# Altium project Node01.PrjPcb
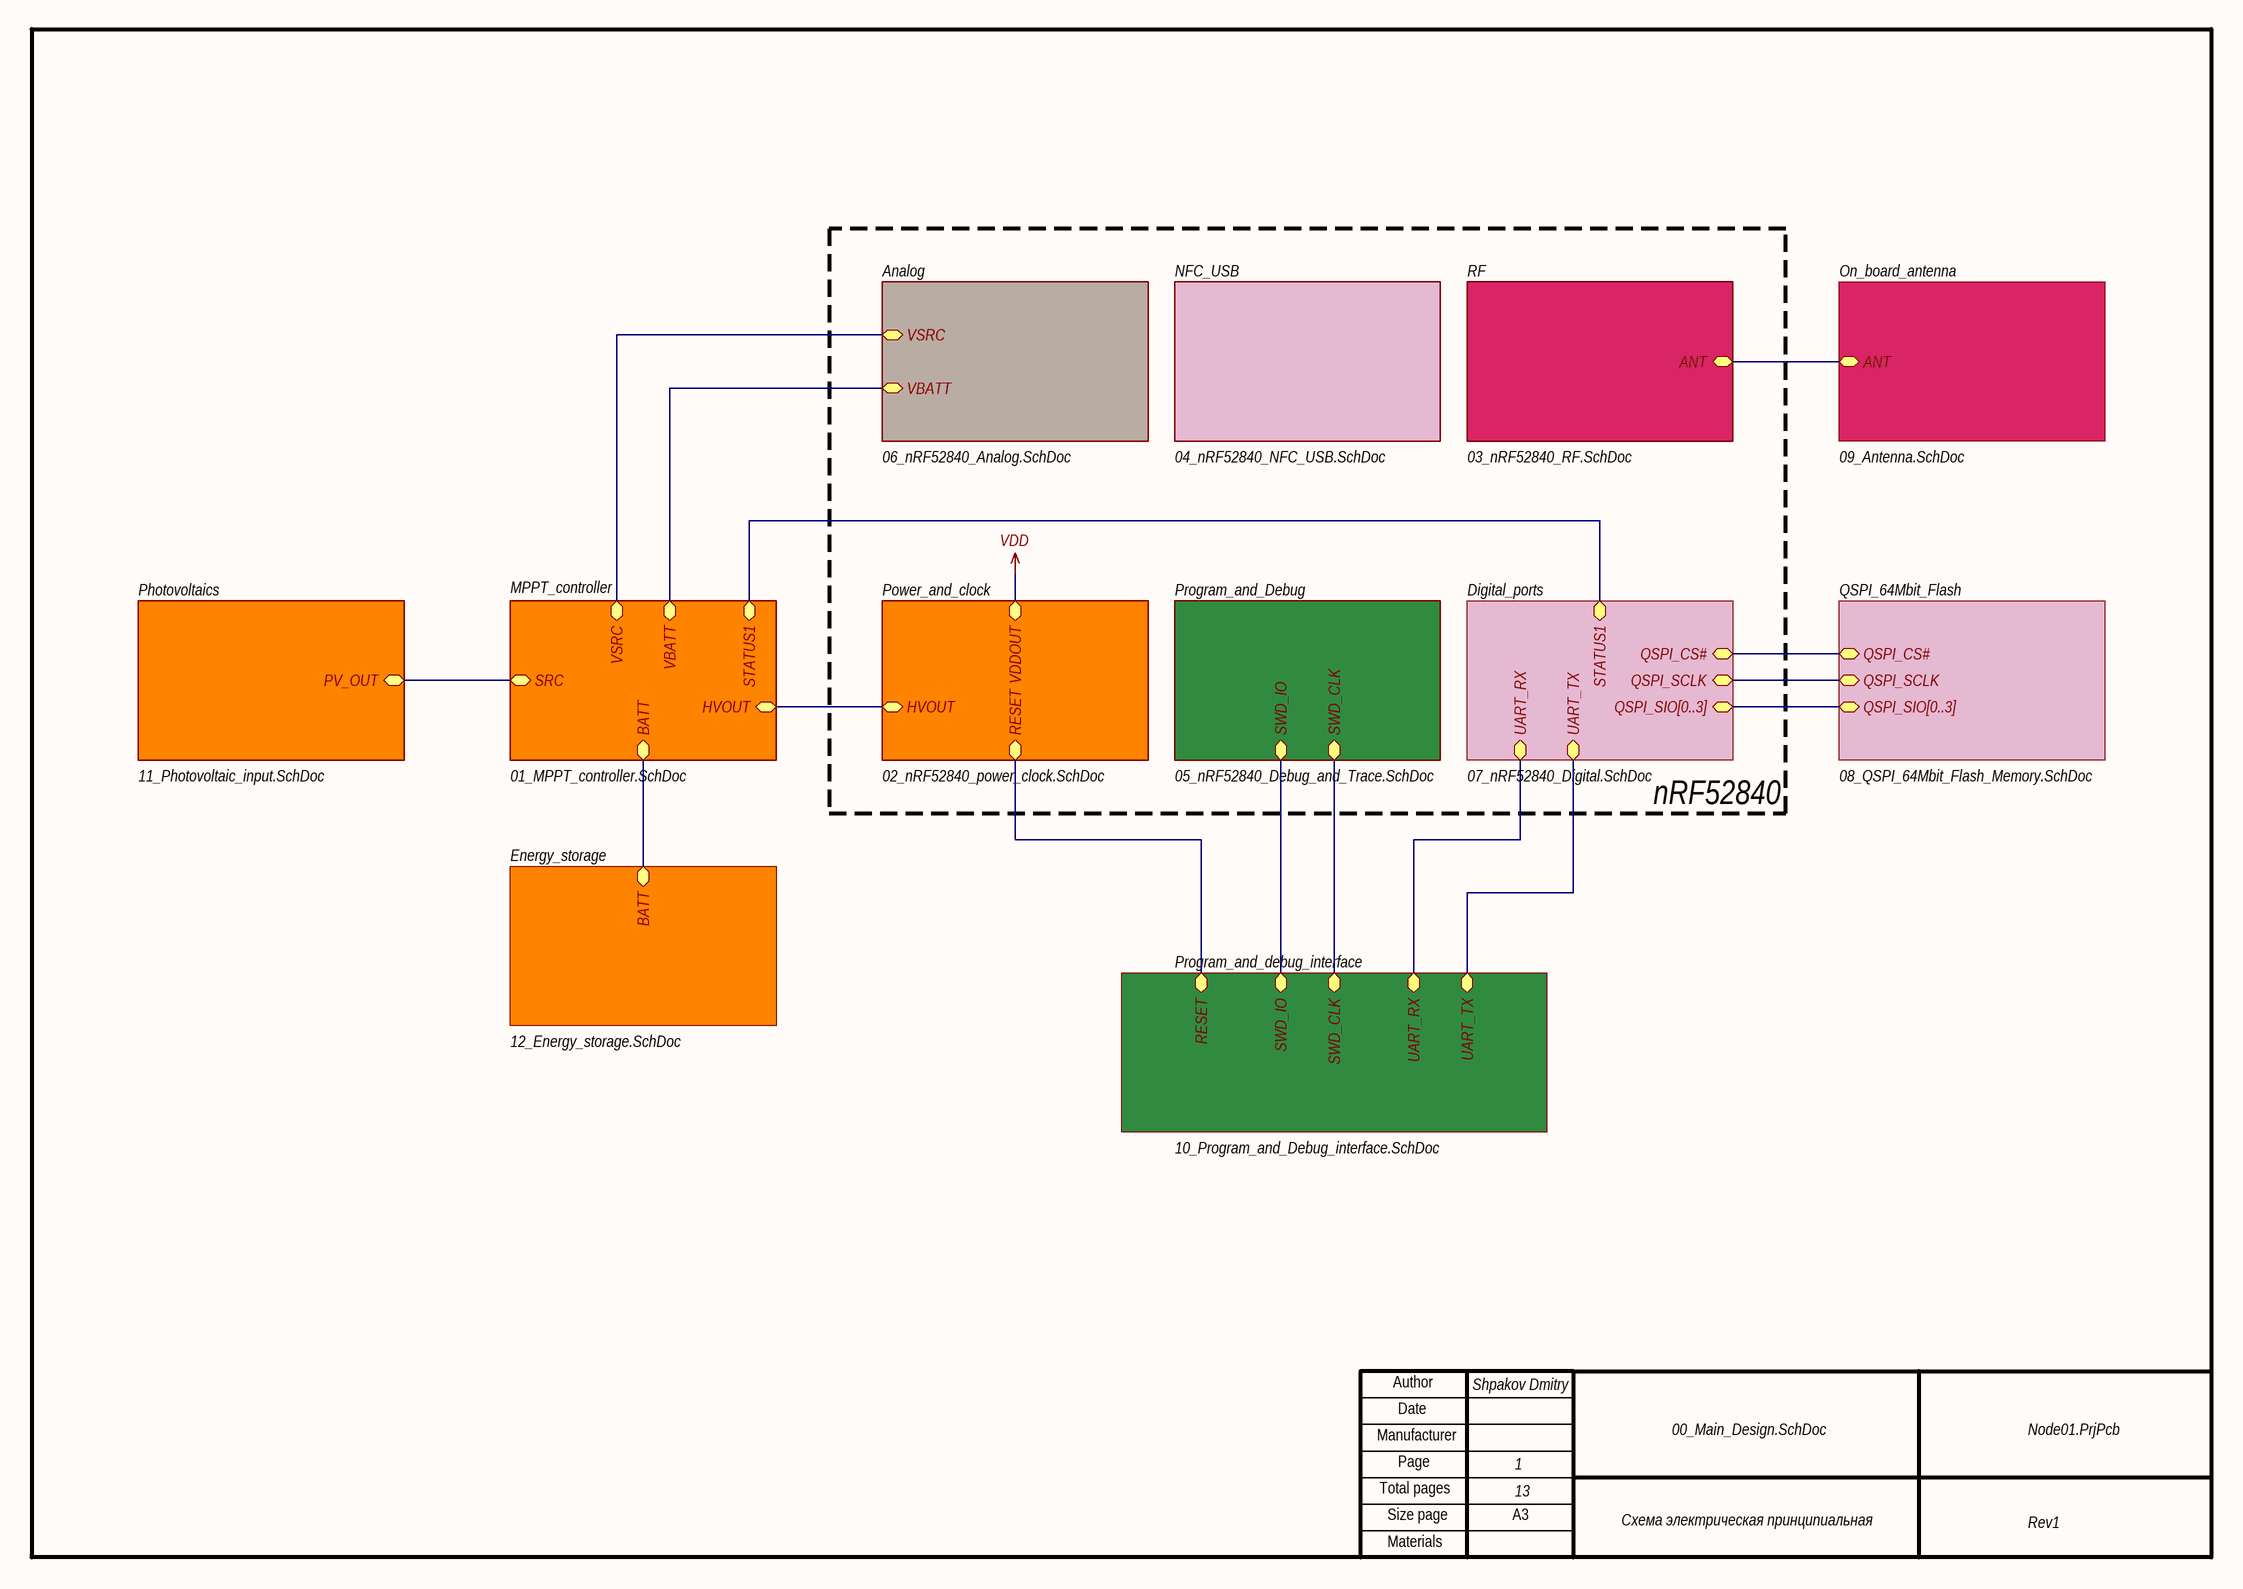
[diagram p0: 00_Main_Design.SchDoc]
ProjectRevision: Rev1
13 sheets, 47 parts. Net scope: hierarchical (ports join the sheet entries above them; power ports are global).
Board file: PCB.PcbDoc
Sheets:
  00_Main_Design.SchDoc
    MPPT_controller = 01_MPPT_controller.SchDoc
    Power_and_clock = 02_nRF52840_power_clock.SchDoc
    RF = 03_nRF52840_RF.SchDoc
    NFC_USB = 04_nRF52840_NFC_USB.SchDoc
    Analog = 06_nRF52840_Analog.SchDoc
    Digital_ports = 07_nRF52840_Digital.SchDoc
    Program_and_Debug = 05_nRF52840_Debug_and_Trace.SchDoc
    QSPI_64Mbit_Flash = 08_QSPI_64Mbit_Flash_Memory.SchDoc
    On_board_antenna = 09_Antenna.SchDoc
    Program_and_debug_interface = 10_Program_and_Debug_interface.SchDoc
    Photovoltaics = 11_Photovoltaic_input.SchDoc
    Energy_storage = 12_Energy_storage.SchDoc

## Sheet 00_Main_Design.SchDoc
size 420 x 297 mm; Author: Shpakov Dmitry; Address1: Address1; Address2: Address2; Address3: Address3; Address4: Address4; DocumentNumber: АБВГ.123456.001 Э3; SheetNumber: 1; SheetTotal: 13; Scale: 1:1; DocumentType: Схема электрическая принципиальная; FirstReferrence: АБВГ.123456.001

### Sub-sheets
Analog = 06_nRF52840_Analog.SchDoc: VSRC, VBATT
Digital_ports = 07_nRF52840_Digital.SchDoc: UART_TX, UART_RX, STATUS1, QSPI_SIO[0..3], QSPI_SCLK, QSPI_CS#
Energy_storage = 12_Energy_storage.SchDoc: BATT
MPPT_controller = 01_MPPT_controller.SchDoc: STATUS1, HVOUT, VSRC, VBATT, SRC, BATT
NFC_USB = 04_nRF52840_NFC_USB.SchDoc: no entries
On_board_antenna = 09_Antenna.SchDoc: ANT
Photovoltaics = 11_Photovoltaic_input.SchDoc: PV_OUT
Power_and_clock = 02_nRF52840_power_clock.SchDoc: HVOUT, RESET, VDDOUT
Program_and_Debug = 05_nRF52840_Debug_and_Trace.SchDoc: SWD_CLK, SWD_IO
Program_and_debug_interface = 10_Program_and_Debug_interface.SchDoc: UART_RX, SWD_IO, UART_TX, RESET, SWD_CLK
QSPI_64Mbit_Flash = 08_QSPI_64Mbit_Flash_Memory.SchDoc: QSPI_SIO[0..3], QSPI_SCLK, QSPI_CS#
RF = 03_nRF52840_RF.SchDoc: ANT

### Nets
VDD: sheet MPPT_controller/HVOUT, sheet Power_and_clock/HVOUT, sheet Power_and_clock/VDDOUT
ANT: sheet RF/ANT, sheet On_board_antenna/ANT
BATT: sheet MPPT_controller/VBATT, sheet MPPT_controller/BATT, sheet Analog/VBATT, sheet Energy_storage/BATT
PV+: sheet MPPT_controller/VSRC, sheet MPPT_controller/SRC, sheet Analog/VSRC, sheet Photovoltaics/PV_OUT
QSPI_CS#: sheet Digital_ports/QSPI_CS#, sheet QSPI_64Mbit_Flash/QSPI_CS#
QSPI_SCLK: sheet Digital_ports/QSPI_SCLK, sheet QSPI_64Mbit_Flash/QSPI_SCLK
RESET: sheet Power_and_clock/RESET, sheet Program_and_debug_interface/RESET
STATUS1: sheet MPPT_controller/STATUS1, sheet Digital_ports/STATUS1
SWD_CLK: sheet Program_and_Debug/SWD_CLK, sheet Program_and_debug_interface/SWD_CLK
SWD_IO: sheet Program_and_Debug/SWD_IO, sheet Program_and_debug_interface/SWD_IO
UART_RX: sheet Digital_ports/UART_RX, sheet Program_and_debug_interface/UART_RX
UART_TX: sheet Digital_ports/UART_TX, sheet Program_and_debug_interface/UART_TX

### Buses and harness runs
bus sheet Digital_ports/QSPI_SIO[0..3] = sheet QSPI_64Mbit_Flash/QSPI_SIO[0..3]

### Notes on the sheet
- nRF52840
- Author
- Manufacturer
- Date
- Page
- Total pages
- Size page
- A3
- Materials

## Sheet 01_MPPT_controller.SchDoc
size 420 x 297 mm; Author: Shpakov Dmitry; Address1: Address1; Address2: Address2; Address3: Address3; Address4: Address4; DocumentNumber: АБВГ.123456.001 Э3; SheetNumber: 2; SheetTotal: 13; Scale: 1:1; DocumentType: Схема электрическая принципиальная; FirstReferrence: АБВГ.123456.001
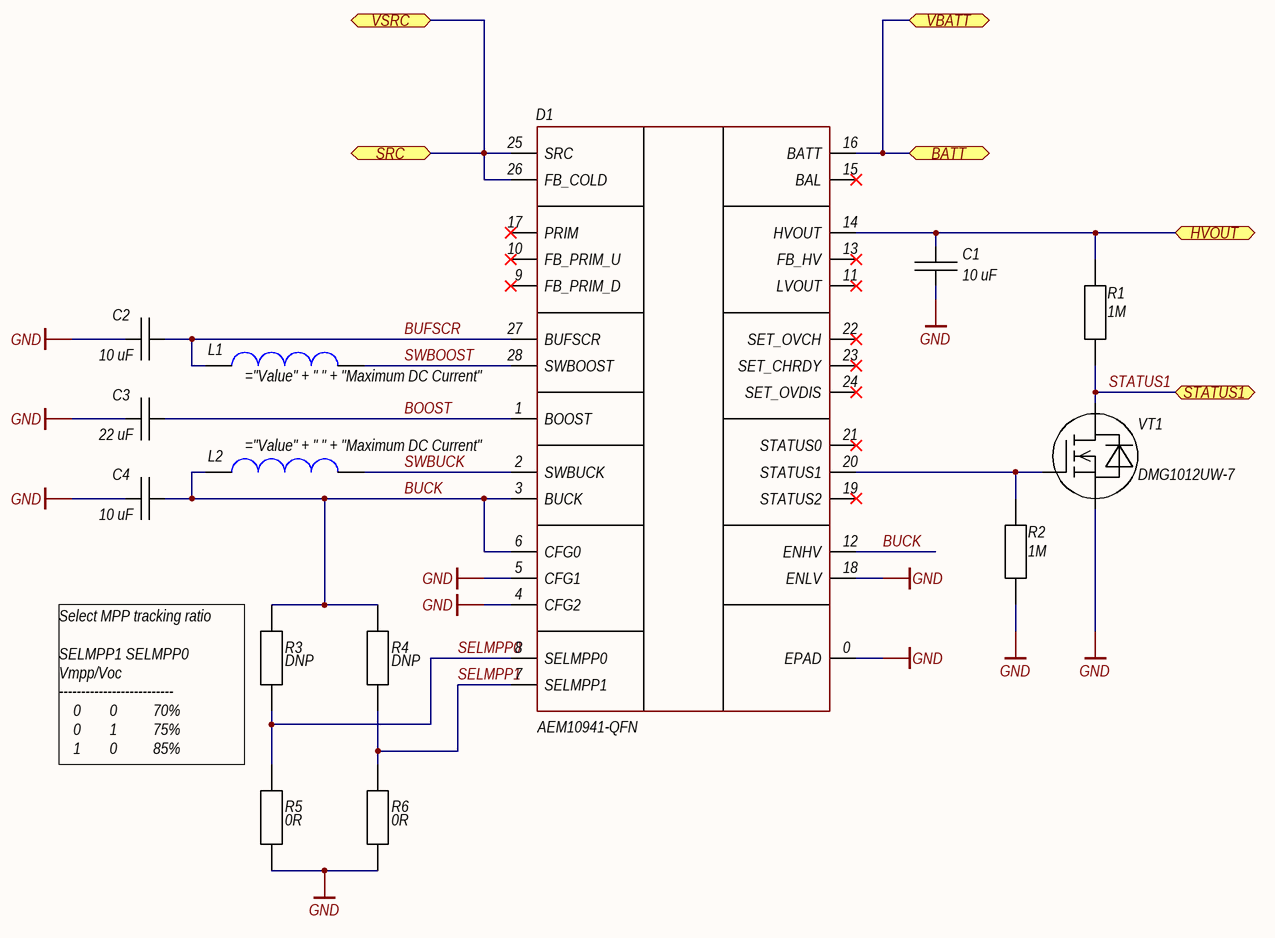
[diagram p1: 01_MPPT_controller.SchDoc]

### Parts
C1  10 uF  [CAPC1608X09N]
C2  10 uF  [CAPC1608X09N]
C3  22 uF  [CAPC1608X09N]
C4  10 uF  [CAPC1608X09N]
D1  PartNumber: AEM10941-QFN  [QFN50P500X500X85_HS-29N]
L1  (no value)  [INDP3939X11N]
L2  (no value)  [INDC1608X08N]
R1  1M  [RESC1608X05N]
R2  1M  [RESC1608X05N]
R3  DNP  [RESC1608X05N]
R4  DNP  [RESC1608X05N]
R5  0R  [RESC1608X05N]
R6  0R  [RESC1608X05N]
VT1  DMG1012UW-7  [SOT65P210X110-3N]

### Ports
BATT, HVOUT, SRC, STATUS1, VBATT, VSRC

### Nets
GND: C1.1 C2.1 C3.1 C4.1 D1.0(EPAD) D1.4(CFG2) D1.5(CFG1) D1.18(ENLV) R2.2 R5.1 R6.1 VT1.2(S)
VDD: C1.2 D1.14(HVOUT) R1.1 ; port HVOUT
BATT: D1.16(BATT) ; port VBATT, port BATT
BOOST: C3.2 D1.1(BOOST)
BUCK: C4.2 D1.3(BUCK) D1.6(CFG0) D1.12(ENHV) L2.1 R3.2 R4.2
BUFSCR: C2.2 D1.27(BUFSCR) L1.1
PV+: D1.25(SRC) D1.26(FB_COLD) ; port VSRC, port SRC
SELMPP0: D1.8(SELMPP0) R3.1 R5.2
SELMPP1: D1.7(SELMPP1) R4.1 R6.2
STATUS1: R1.2 VT1.3(D) ; port STATUS1
SWBOOST: D1.28(SWBOOST) L1.2
SWBUCK: D1.2(SWBUCK) L2.2
NetD1_20: D1.20(STATUS1) R2.1 VT1.1(G)

Not connected (* = marked no-connect by the designer): D1 9(FB_PRIM_D)* 10(FB_PRIM_U)* 11(LVOUT)* 13(FB_HV)* 15(BAL)* 17(PRIM)* 19(STATUS2)* 21(STATUS0)* 22(SET_OVCH)* 23(SET_CHRDY)* 24(SET_OVDIS)*

### Notes on the sheet
- Select MPP tracking ratio
  SELMPP1 SELMPP0 Vmpp/Voc
  --------------------------
  0        0          70%
  0        1          75%
  1        0          85%
  1        1          90%
- Author
- Manufacturer
- Date
- Page
- Total pages
- Size page
- A3
- Materials

### Library data of the parts
C1 C2 C4 = Ceramic: Ceramic capacitor; Manufacturer: Murata Electronics; PartNumber: GRM188R61A106ME69D; Power/Voltage: 10 VDC; Tolerance: 20 %; Operation Temperature: -55...+85; Note: X5R, General purpose; Help URL: https://eu.mouser.com/ProductDetail/Murata-Electronics/GRM188R61A106ME69D?qs=o98hbGm2QKGN31NsNZp5HQ%3D%3D; Type: ceramic capacitor; Value: 10 uF; Case: 0603
C3 = Ceramic: Ceramic capacitor; Manufacturer: Murata Electronics; PartNumber: GRM188R61A226ME15D; Power/Voltage: 10 VDC; Tolerance: 20 %; Operation Temperature: -55...+85; Note: X5R, General purpose; Help URL: https://eu.mouser.com/ProductDetail/Murata-Electronics/GRM188R61A226ME15D?qs=eeBpzGFlv%252B8DV%2FrilzyhAw%3D%3D; Type: ceramic capacitor; Value: 22 uF; Case: 0603
D1 = AEM10941-QFN28: Intergated energy management circuit that extracts DC power from up to 7-cell solar panels. With MPPT controller.; Manufacturer: e-peas; Type: PV energy harvester; Power/Voltage: 550mW; Operation Temperature: -40...+125 °C; Help URL: https://eu.mouser.com/ProductDetail/e-peas/AEM10941-QFN?qs=W%2FMpXkg%252BdQ7CeqB2lBPbRQ%3D%3D; Value: *; Tolerance: *; Note: *
L1 = Inductor: Manufacturer: Coilcraft; PartNumber: LPS4012-103MRB; Value: 10 uH; Tolerance: 20 %; Operation Temperature: -40...+85; Maximum DC Current: 750 mA; Maximum DC Resistance: 350 mOhm; Saturation Current: 1.1 A; Help URL: https://eu.mouser.com/ProductDetail/Coilcraft/LPS4012-103MRB?qs=QQJxVsr8EGamsM0letHvkQ%3D%3D; Power/Voltage: *; Type: inductor; Note: *; Case: 1515
L2 = Inductor: Manufacturer: TDK; PartNumber: MLZ1608M100WT000; Value: 10 uH; Tolerance: 20 %; Operation Temperature: -55...+125; Maximum DC Current: 250 mA; Maximum DC Resistance: 1.05 Ohm; Saturation Current: 90 mA; Help URL: https://eu.mouser.com/ProductDetail/TDK/MLZ1608M100WT000?qs=%2Fha2pyFaduj6%252B0RWY0sGlNh8Rxwgn4kiVfSaAvWnFwX0N61hyAW%252BjQ%3D%3D; Power/Voltage: *; Type: inductor; Note: *; Case: 0603
R1 R2 = resistor_smd: SMD resistor; Manufacturer: Yageo; PartNumber: RC0603JR-071ML; Power/Voltage: 1/10W; Tolerance: 5%; Operation Temperature: -55...+155; Note: Thick film; Help URL: https://www.digikey.com/en/products/detail/yageo/RC0603JR-071ML/726678; Type: resistor; Value: 1M; Case: 0603
R3-R6 = resistor_smd: SMD resistor; Manufacturer: Yageo; PartNumber: AC0603FR-070RL; Power/Voltage: 1/10 W, 75 V; Tolerance: 1 %; Operation Temperature: -55...+155; Help URL: https://eu.mouser.com/ProductDetail/Yageo/AC0603FR-070RL?qs=sGAEpiMZZMtlubZbdhIBIOG3KwTtqrl%2FD2D%252BGuMCfoY%3D; Type: resistor, Thick Film General Purpose; Case: 0603
  R3 R4: Value: DNP; Note: DNP
  R5 R6: Value: 0R
VT1 = DMF1012UW N-channel MOSFET: MOSFET DMG1012UW , N-channel, 20V, 1A; Manufacturer: Diodes Incorporated; Power/Voltage: 20V, 290mW; Type: MOSFET N-channel; Operation Temperature: -55...+150; PartNumber: DMG1012UW-7; Help URL: https://www.digikey.com/en/products/detail/diodes-incorporated/DMG1012UW-7/2183239?s=N4IgTCBcDaICYFsDmBGADCsBXA7iAugL5A; Value: *; Tolerance: *; Note: *; Case: SOT323

## Sheet 02_nRF52840_power_clock.SchDoc
size 420 x 297 mm; Author: Shpakov Dmitry; Address1: Address1; Address2: Address2; Address3: Address3; Address4: Address4; DocumentNumber: АБВГ.123456.001 Э3; SheetNumber: 3; SheetTotal: 13; Scale: 1:1; DocumentType: Схема электрическая принципиальная; FirstReferrence: АБВГ.123456.001
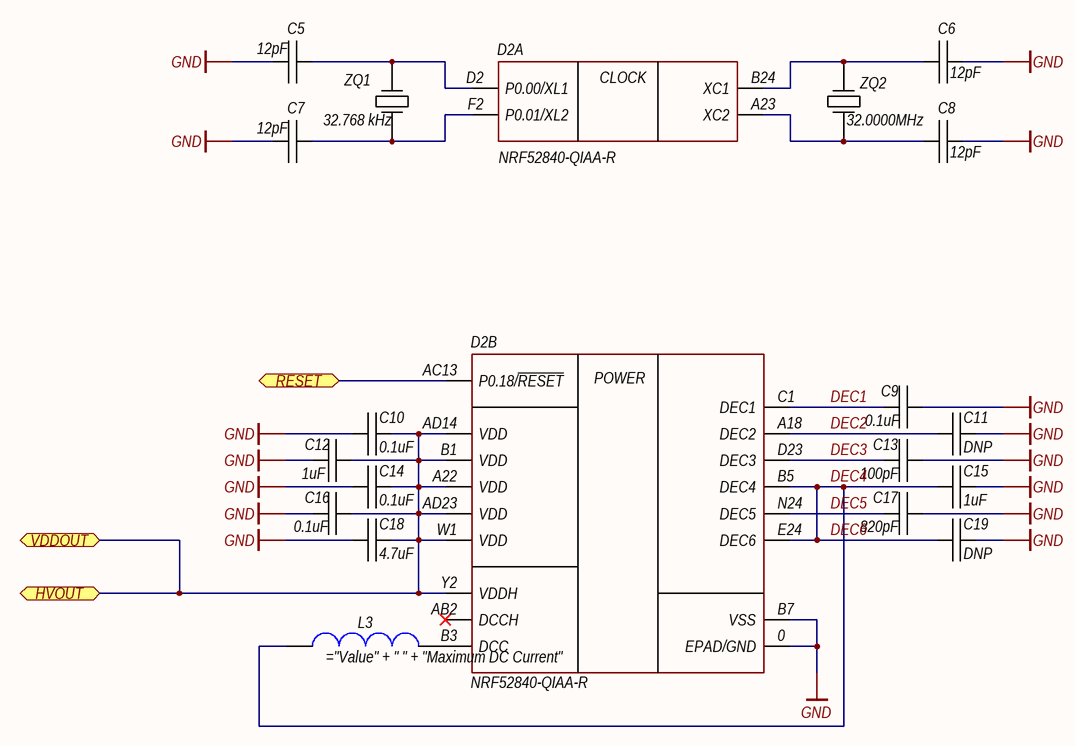
[diagram p2: 02_nRF52840_power_clock.SchDoc]

### Parts
C5  12pF  [CAPC1608X09N]
C6  12pF  [CAPC1608X09N]
C7  12pF  [CAPC1608X09N]
C8  12pF  [CAPC1608X09N]
C9  0.1uF  [CAPC1608X09N]
C10  0.1uF  [CAPC1608X09N]
C11  DNP  [CAPC1608X09N]
C12  1uF  [CAPC1608X09N]
C13  100pF  [CAPC1608X09N]
C14  0.1uF  [CAPC1608X09N]
C15  1uF  [CAPC1608X09N]
C16  0.1uF  [CAPC1608X09N]
C17  820pF  [CAPC1608X09N]
C18  4.7uF  [CAPC1608X09N]
C19  DNP  [CAPC1608X09N]
D2  NRF52840-QIAA-R  [AQFN50P700X700X85_HS-74N]  (parts A,B of 9)
L3  (no value)  [INDC1608X08N]
ZQ1  32.768 kHz  [ECX-16]
ZQ2  32.0000MHz  [ABM11W-32.0000MHZ-8-D1X-T3]

### Ports
HVOUT, RESET, VDDOUT

### Nets
GND: C5.1 C6.2 C7.1 C8.2 C9.2 C10.1 C11.2 C12.1 C13.2 C14.1 C15.2 C16.1 C17.2 C18.1 C19.2 D2.0(EPAD/GND) D2.B7(VSS) ZQ2.2 ZQ2.4
VDD: C10.2 C12.2 C14.2 C16.2 C18.2 D2.A22(VDD) D2.AD14(VDD) D2.AD23(VDD) D2.B1(VDD) D2.W1(VDD) D2.Y2(VDDH) ; port HVOUT, port VDDOUT
DEC1: C9.1 D2.C1(DEC1)
DEC2: C11.1 D2.A18(DEC2)
DEC3: C13.1 D2.D23(DEC3)
DEC4: C15.1 C19.1 D2.B5(DEC4) D2.E24(DEC6) L3.1  [also labelled DEC6]
DEC5: C17.1 D2.N24(DEC5)
RESET: D2.AC13(P0.18/~{RESET}) ; port RESET
NetC5_2: C5.2 D2.D2(P0.00/XL1) ZQ1.2
NetC6_1: C6.1 D2.B24(XC1) ZQ2.3
NetC7_2: C7.2 D2.F2(P0.01/XL2) ZQ1.1
NetC8_1: C8.1 D2.A23(XC2) ZQ2.1
NetD2_B3: D2.B3(DCC) L3.2

Not connected (* = marked no-connect by the designer): D2 AB2(DCCH)*

### Notes on the sheet
- Author
- Manufacturer
- Date
- Page
- Total pages
- Size page
- A3
- Materials
- (in symbol nRF52840-QFN373, part A) CLOCK
- (in symbol nRF52840-QFN373, part B) POWER

### Library data of the parts
C5-C8 = Ceramic: Ceramic capacitor; Manufacturer: Yageo; PartNumber: CC0603JRNPO9BN120; Power/Voltage: 50V; Tolerance: 5%; Operation Temperature: -55...+125; Help URL: https://www.digikey.com/en/products/detail/yageo/CC0603JRNPO9BN120/302793; Type: capacitor; Value: 12pF; Note: *; Case: 0603
C9 C10 C14 C16 = Ceramic: Ceramic capacitor; Manufacturer: Würth Elektronik; PartNumber: 885012206071; Power/Voltage: 25V; Tolerance: 10%; Operation Temperature: -55...+125; Help URL: https://www.digikey.com/en/products/detail/w%C3%BCrth-elektronik/885012206071/5453844; Type: capacitor; Value: 0.1uF; Note: *; Case: 0603
C11 C19 = Ceramic: Ceramic capacitor; Manufacturer: *; PartNumber: *; Help URL: *; Type: capacitor; Power/Voltage: *; Value: DNP; Tolerance: *; Operation Temperature: *; Note: *; Case: 0603
C12 C15 = Ceramic: Ceramic capacitor; Manufacturer: Würth Elektronik; PartNumber: 885012106010; Power/Voltage: 10V; Tolerance: 20%; Operation Temperature: -55...+85; Help URL: https://www.digikey.com/en/products/detail/w%C3%BCrth-elektronik/885012106010/5453762; Type: capacitor; Value: 1uF; Note: *; Case: 0603
C13 = Ceramic: Ceramic capacitor; Manufacturer: Würth Elektronik; PartNumber: 885342006003; Power/Voltage: 250V; Tolerance: 5%; Operation Temperature: -55...+125; Help URL: https://www.digikey.com/en/products/detail/w%C3%BCrth-elektronik/885342006003/9345979; Type: capacitor; Value: 100pF; Note: *; Case: 0603
C17 = Ceramic: Ceramic capacitor; Manufacturer: Yageo; PartNumber: CC0603KRX7R9BB821; Power/Voltage: 50V; Tolerance: 10%; Operation Temperature: -55...+125; Help URL: https://www.digikey.com/en/products/detail/yageo/CC0603KRX7R9BB821/372862; Type: capacitor; Value: 820pF; Note: *; Case: 0603
C18 = Ceramic: Ceramic capacitor; Manufacturer: Würth Elektronik; PartNumber: 885012106005; Power/Voltage: 6.3V; Tolerance: 20%; Operation Temperature: -55...+85; Help URL: https://www.digikey.com/en/products/detail/w%C3%BCrth-elektronik/885012106005/5453757; Type: capacitor; Value: 4.7uF; Note: *; Case: 0603
D2 = nRF52840-QFN373: IC RF TxRx + MCU 802.15.4, Bluetooth Bluetooth v5.0 2.4GHz 73-VFQFN Dual Rows, Exposed Pad; Manufacturer: Nordic Semiconductor ASA; Power/Voltage: 1.7V ~ 5.5V; Operation Temperature: -40...+85; Help URL: https://www.digikey.com/en/products/detail/nexperia-usa-inc/2N7002-215/762973; Type: IC RF TXRX+MCU 802.15.4; Value: *; Tolerance: *; Note: *; Case: 73-aQFN (7x7); PartNumber: NRF52840-QIAA-R
L3 = Inductor: Manufacturer: Murata Electronics; PartNumber: LQM18FN100M00D; Value: 10 uH; Tolerance: 20 %; Operation Temperature: -55...+125; Maximum DC Current: 50 mA; Maximum DC Resistance: 1.17 Ohm; Help URL: https://www.digikey.com/en/products/detail/murata-electronics/LQM18FN100M00D/1016184; Power/Voltage: *; Type: inductor; Note: *; Case: 0603; Saturation Current: 50 mA
ZQ1 = ECS-.327-9-16-TR: CRYSTAL 32.7680KHZ 9PF SMD ±20ppm Crystal 9pF 2-SMD, No Lead; Manufacturer: ECS Inc.; Operation Temperature: -40...+85; PartNumber: ECS-.327-9-16-TR; Help URL: https://www.digikey.com/en/products/detail/ecs-inc/ECS-327-9-16-TR/5875558; Power/Voltage: *; Type: crystal oscillator, tunning fork; Value: 32.768 kHz; Tolerance: 20ppm; Note: *; Case: 2-SMD, No Lead
ZQ2 = ABM11W-32.0000MHZ-8-D1X-T3: CRYSTAL 32.0000MHZ 8PF SMD, ±10ppm Crystal 8pF 4-SMD, No Lead; Manufacturer: Abracon LLC; Operation Temperature: -40...+85; PartNumber: ABM11W-32.0000MHZ-8-D1X-T3; Help URL: https://www.digikey.com/en/products/detail/abracon-llc/ABM11W-32-0000MHZ-8-D1X-T3/7172671; Power/Voltage: *; Type: crystal oscillator; Value: 32.0000MHz; Tolerance: 10ppm; Note: *; Case: 4-SMD, No Lead

## Sheet 03_nRF52840_RF.SchDoc
size 420 x 297 mm; Author: Shpakov Dmitry; Address1: Address1; Address2: Address2; Address3: Address3; Address4: Address4; DocumentNumber: АБВГ.123456.001 Э3; SheetNumber: 4; SheetTotal: 13; Scale: 1:1; DocumentType: Схема электрическая принципиальная; FirstReferrence: АБВГ.123456.001
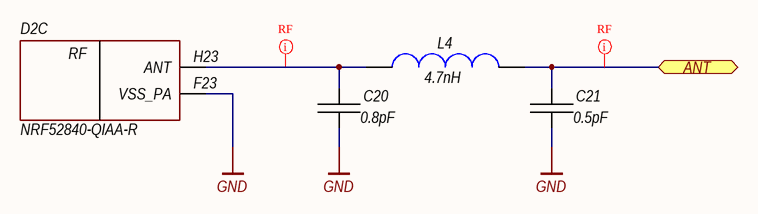
[diagram p3: 03_nRF52840_RF.SchDoc]

### Parts
C20  0.8pF  [CAPC1608X09N]
C21  0.5pF  [CAPC1608X09N]
D2  NRF52840-QIAA-R  [AQFN50P700X700X85_HS-74N]  (part C of 9)
L4  4.7nH  [INDC1608X08N]

### Ports
ANT

### Nets
GND: C20.1 C21.1 D2.F23(VSS_PA)
ANT: C21.2 L4.2 ; port ANT
NetC20_2: C20.2 D2.H23(ANT) L4.1

### Layout directives
rule Undefined: ANT, NetC20_2

### Notes on the sheet
- Author
- Manufacturer
- Date
- Page
- Total pages
- Size page
- A3
- Materials
- (in symbol nRF52840-QFN373, part C) RF

### Library data of the parts
C20 = Ceramic: Ceramic capacitor; Manufacturer: Murata Electronics; PartNumber: GQM1875C2ER80BB12D; Power/Voltage: 250V; Tolerance: 0.1pF; Operation Temperature: -55...+125; Help URL: https://www.digikey.com/en/products/detail/murata-electronics/GQM1875C2ER80BB12D/11618603; Type: capacitor; Value: 0.8pF; Note: *; Case: 0603
C21 = Ceramic: Ceramic capacitor; Manufacturer: Murata Electronics; PartNumber: GQM1875C2ER50WB12D; Power/Voltage: 250V; Tolerance: 0.05pF; Operation Temperature: -55...+125; Help URL: https://www.digikey.com/en/products/detail/murata-electronics/GQM1875C2ER50WB12D/11618602; Type: capacitor; Value: 0.5pF; Note: *; Case: 0603
D2 = nRF52840-QFN373: as D2 on sheet 02_nRF52840_power_clock; Help URL: https://www.digikey.com/en/products/detail/nexperia-usa-inc/2N7002-215/762973; Type: IC RF TXRX+MCU 802.15.4; Value: *; Tolerance: *; Note: *; Case: 73-aQFN (7x7); PartNumber: NRF52840-QIAA-R
L4 = Inductor: Manufacturer: AVX Corporation; PartNumber: L06034R7CGSTR; Tolerance: 0.2nH; Operation Temperature: -55...+125; Maximum DC Current: 500mA; Maximum DC Resistance: 150 mOhm; Q @ freq: 23 @ 450MHz; Frequency self resonant: 5.5GHz; Help URL: https://www.digikey.com/en/products/detail/avx-corporation/L06034R7CGSTR/1531806; Power/Voltage: *; Type: inductor; Value: 4.7nH; Note: *; Case: 0603; Saturation Current: *

## Sheet 04_nRF52840_NFC_USB.SchDoc
size 420 x 297 mm; Author: Shpakov Dmitry; Address1: Address1; Address2: Address2; Address3: Address3; Address4: Address4; DocumentNumber: АБВГ.123456.001 Э3; SheetNumber: 5; SheetTotal: 13; Scale: 1:1; DocumentType: Схема электрическая принципиальная; FirstReferrence: АБВГ.123456.001
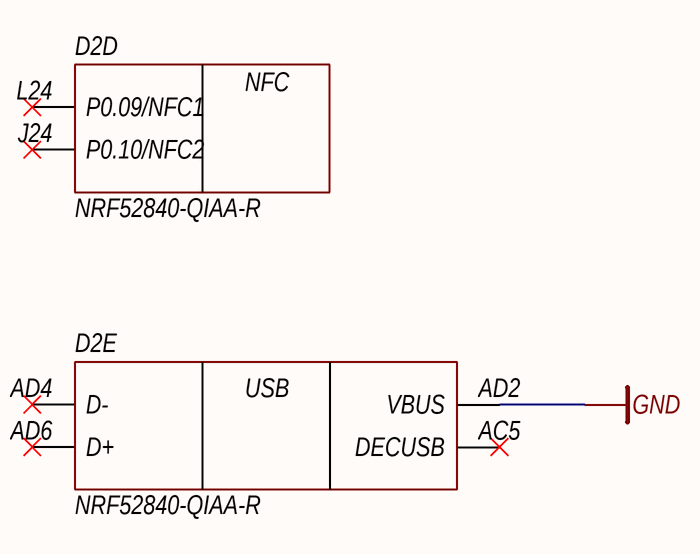
[diagram p4: 04_nRF52840_NFC_USB.SchDoc]

### Parts
D2  NRF52840-QIAA-R  [AQFN50P700X700X85_HS-74N]  (parts D,E of 9)

### Nets
GND: D2.AD2(VBUS)

Not connected (* = marked no-connect by the designer): D2 AC5(DECUSB)* AD4(D-)* AD6(D+)* J24(P0.10/NFC2)* L24(P0.09/NFC1)*

### Notes on the sheet
- Author
- Manufacturer
- Date
- Page
- Total pages
- Size page
- A3
- Materials
- (in symbol nRF52840-QFN373, part D) NFC
- (in symbol nRF52840-QFN373, part E) USB

### Library data of the parts
D2 = nRF52840-QFN373: as D2 on sheet 02_nRF52840_power_clock; Help URL: https://www.digikey.com/en/products/detail/nexperia-usa-inc/2N7002-215/762973; Type: IC RF TXRX+MCU 802.15.4; Value: *; Tolerance: *; Note: *; Case: 73-aQFN (7x7); PartNumber: NRF52840-QIAA-R

## Sheet 06_nRF52840_Analog.SchDoc
size 420 x 297 mm; Author: Shpakov Dmitry; Address1: Address1; Address2: Address2; Address3: Address3; Address4: Address4; DocumentNumber: АБВГ.123456.001 Э3; SheetNumber: 7; SheetTotal: 13; Scale: 1:1; DocumentType: Схема электрическая принципиальная; FirstReferrence: АБВГ.123456.001
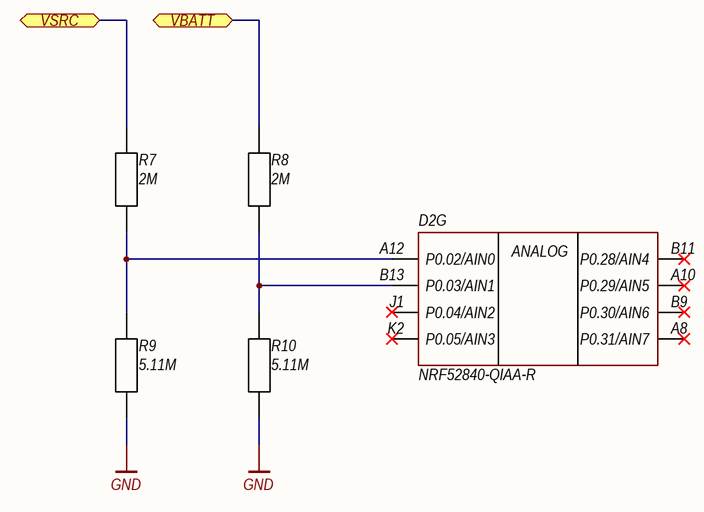
[diagram p5: 06_nRF52840_Analog.SchDoc]

### Parts
D2  NRF52840-QIAA-R  [AQFN50P700X700X85_HS-74N]  (part G of 9)
R7  2M  [RESC1608X05N]
R8  2M  [RESC1608X05N]
R9  5.11M  [RESC1608X05N]
R10  5.11M  [RESC1608X05N]

### Ports
VBATT, VSRC

### Nets
GND: R9.1 R10.1
BATT: R8.2 ; port VBATT
PV+: R7.2 ; port VSRC
NetD2_A12: D2.A12(P0.02/AIN0) R7.1 R9.2
NetD2_B13: D2.B13(P0.03/AIN1) R8.1 R10.2

Not connected (* = marked no-connect by the designer): D2 A8(P0.31/AIN7)* A10(P0.29/AIN5)* B9(P0.30/AIN6)* B11(P0.28/AIN4)* J1(P0.04/AIN2)* K2(P0.05/AIN3)*

### Notes on the sheet
- Author
- Manufacturer
- Date
- Page
- Total pages
- Size page
- A3
- Materials
- (in symbol nRF52840-QFN373, part G) ANALOG

### Library data of the parts
D2 = nRF52840-QFN373: as D2 on sheet 02_nRF52840_power_clock; Help URL: https://www.digikey.com/en/products/detail/nexperia-usa-inc/2N7002-215/762973; Type: IC RF TXRX+MCU 802.15.4; Value: *; Tolerance: *; Note: *; Case: 73-aQFN (7x7); PartNumber: NRF52840-QIAA-R
R7 R8 = resistor_smd: SMD resistor; Manufacturer: Yageo; PartNumber: RC0603JR-072ML; Power/Voltage: 1/10W; Tolerance: 5%; Operation Temperature: -55...+155; Help URL: https://www.digikey.com/en/products/detail/yageo/RC0603JR-072ML/726727; Type: resistor; Value: 2M; Note: *; Case: 0603
R9 R10 = resistor_smd: SMD resistor; Manufacturer: Yageo; PartNumber: RC0603FR-075M11L; Power/Voltage: 1/10; Tolerance: 1%; Operation Temperature: -55...+155; Help URL: https://www.digikey.com/en/products/detail/yageo/RC0603FR-075M11L/5918377; Type: resistor; Value: 5.11M; Note: *; Case: 0603

## Sheet 07_nRF52840_Digital.SchDoc
size 420 x 297 mm; Author: Shpakov Dmitry; Address1: Address1; Address2: Address2; Address3: Address3; Address4: Address4; DocumentNumber: АБВГ.123456.001 Э3; SheetNumber: 8; SheetTotal: 13; Scale: 1:1; DocumentType: Схема электрическая принципиальная; FirstReferrence: АБВГ.123456.001
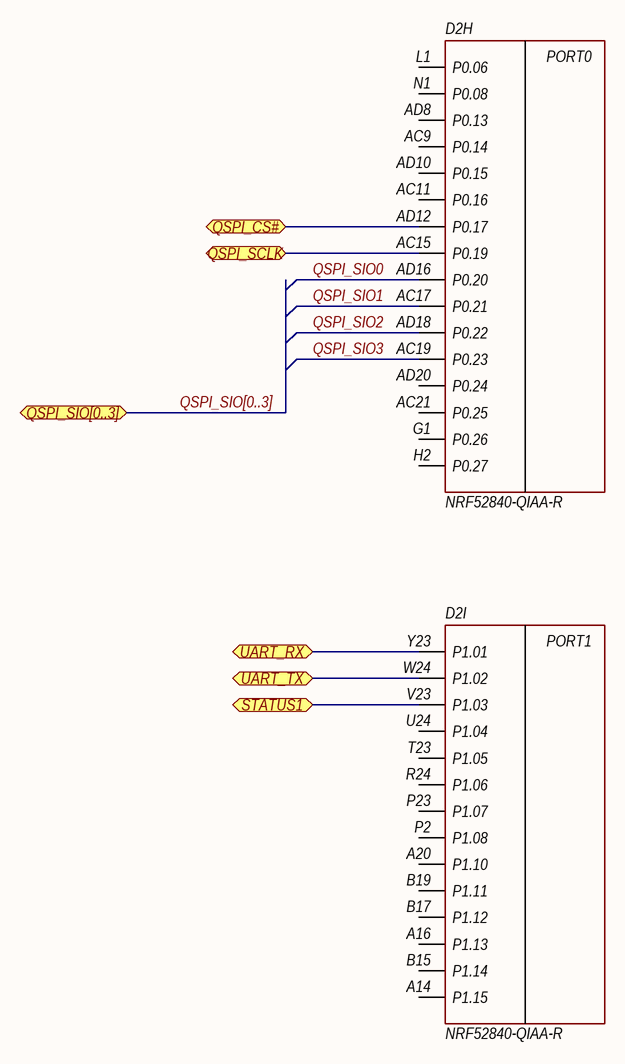
[diagram p6: 07_nRF52840_Digital.SchDoc]

### Parts
D2  NRF52840-QIAA-R  [AQFN50P700X700X85_HS-74N]  (parts H,I of 9)

### Ports
QSPI_CS#, QSPI_SCLK, QSPI_SIO[0..3], STATUS1, UART_RX, UART_TX

### Nets
QSPI_CS#: D2.AD12(P0.17) ; port QSPI_CS#
QSPI_SCLK: D2.AC15(P0.19) ; port QSPI_SCLK
QSPI_SIO0: D2.AD16(P0.20)
QSPI_SIO1: D2.AC17(P0.21)
QSPI_SIO2: D2.AD18(P0.22)
QSPI_SIO3: D2.AC19(P0.23)
STATUS1: D2.V23(P1.03) ; port STATUS1
UART_RX: D2.Y23(P1.01) ; port UART_RX
UART_TX: D2.W24(P1.02) ; port UART_TX

Not connected (* = marked no-connect by the designer): D2 A14(P1.15) A16(P1.13) A20(P1.10) AC9(P0.14) AC11(P0.16) AC21(P0.25) AD8(P0.13) AD10(P0.15) AD20(P0.24) B15(P1.14) B17(P1.12) B19(P1.11) G1(P0.26) H2(P0.27) L1(P0.06) N1(P0.08) P2(P1.08) P23(P1.07) R24(P1.06) T23(P1.05) U24(P1.04)

### Buses and harness runs
bus QSPI_SIO[0..3] = port QSPI_SIO[0..3]

### Notes on the sheet
- Author
- Manufacturer
- Date
- Page
- Total pages
- Size page
- A3
- Materials
- (in symbol nRF52840-QFN373, part H) PORT0
- (in symbol nRF52840-QFN373, part I) PORT1

### Library data of the parts
D2 = nRF52840-QFN373: as D2 on sheet 02_nRF52840_power_clock; Help URL: https://www.digikey.com/en/products/detail/nexperia-usa-inc/2N7002-215/762973; Type: IC RF TXRX+MCU 802.15.4; Value: *; Tolerance: *; Note: *; Case: 73-aQFN (7x7); PartNumber: NRF52840-QIAA-R

## Sheet 05_nRF52840_Debug_and_Trace.SchDoc
size 420 x 297 mm; Author: Shpakov Dmitry; Address1: Address1; Address2: Address2; Address3: Address3; Address4: Address4; DocumentNumber: АБВГ.123456.001 Э3; SheetNumber: 6; SheetTotal: 13; Scale: 1:1; DocumentType: Схема электрическая принципиальная; FirstReferrence: АБВГ.123456.001
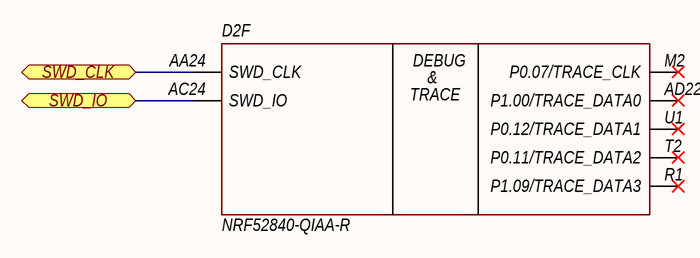
[diagram p7: 05_nRF52840_Debug_and_Trace.SchDoc]

### Parts
D2  NRF52840-QIAA-R  [AQFN50P700X700X85_HS-74N]  (part F of 9)

### Ports
SWD_CLK, SWD_IO

### Nets
SWD_CLK: D2.AA24(SWD_CLK) ; port SWD_CLK
SWD_IO: D2.AC24(SWD_IO) ; port SWD_IO

Not connected (* = marked no-connect by the designer): D2 AD22(P1.00/TRACE_DATA0)* M2(P0.07/TRACE_CLK)* R1(P1.09/TRACE_DATA3)* T2(P0.11/TRACE_DATA2)* U1(P0.12/TRACE_DATA1)*

### Notes on the sheet
- Author
- Manufacturer
- Date
- Page
- Total pages
- Size page
- A3
- Materials
- (in symbol nRF52840-QFN373, part F) DEBUG; &; TRACE

### Library data of the parts
D2 = nRF52840-QFN373: as D2 on sheet 02_nRF52840_power_clock; Help URL: https://www.digikey.com/en/products/detail/nexperia-usa-inc/2N7002-215/762973; Type: IC RF TXRX+MCU 802.15.4; Value: *; Tolerance: *; Note: *; Case: 73-aQFN (7x7); PartNumber: NRF52840-QIAA-R

## Sheet 08_QSPI_64Mbit_Flash_Memory.SchDoc
size 420 x 297 mm; Author: Shpakov Dmitry; Address1: Address1; Address2: Address2; Address3: Address3; Address4: Address4; DocumentNumber: АБВГ.123456.001 Э3; SheetNumber: 9; SheetTotal: 13; Scale: 1:1; DocumentType: Схема электрическая принципиальная; FirstReferrence: АБВГ.123456.001
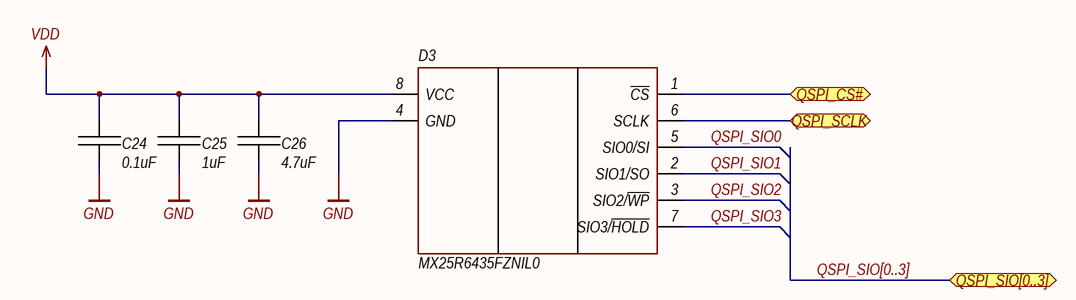
[diagram p8: 08_QSPI_64Mbit_Flash_Memory.SchDoc]

### Parts
C24  0.1uF  [CAPC1608X09N]
C25  1uF  [CAPC1608X09N]
C26  4.7uF  [CAPC1608X09N]
D3  MX25R6435FZNIL0  [SON127P600X80_HS-9N]

### Ports
QSPI_CS#, QSPI_SCLK, QSPI_SIO[0..3]

### Nets
GND: C24.1 C25.2 C26.1 D3.0(EPAD) D3.4(GND)
VDD: C24.2 C25.1 C26.2 D3.8(VCC)
QSPI_CS#: D3.1(~{CS}) ; port QSPI_CS#
QSPI_SCLK: D3.6(SCLK) ; port QSPI_SCLK
QSPI_SIO0: D3.5(SIO0/SI)
QSPI_SIO1: D3.2(SIO1/SO)
QSPI_SIO2: D3.3(SIO2/~{WP})
QSPI_SIO3: D3.7(SIO3/~{HOLD})

### Buses and harness runs
bus QSPI_SIO[0..3] = port QSPI_SIO[0..3]

### Notes on the sheet
- Author
- Manufacturer
- Date
- Page
- Total pages
- Size page
- A3
- Materials

### Library data of the parts
C24 = Ceramic: as C9 on sheet 02_nRF52840_power_clock; Help URL: https://www.digikey.com/en/products/detail/w%C3%BCrth-elektronik/885012206071/5453844; Type: capacitor; Value: 0.1uF; Note: *; Case: 0603
C25 = Ceramic: as C12 on sheet 02_nRF52840_power_clock; Help URL: https://www.digikey.com/en/products/detail/w%C3%BCrth-elektronik/885012106010/5453762; Type: capacitor; Value: 1uF; Note: *; Case: 0603
C26 = Ceramic: as C18 on sheet 02_nRF52840_power_clock; Help URL: https://www.digikey.com/en/products/detail/w%C3%BCrth-elektronik/885012106005/5453757; Type: capacitor; Value: 4.7uF; Note: *; Case: 0603
D3 = MX25R6435FZNIL0: FLASH - NOR Memory IC 64Mb (8M x 8) SPI - Quad I/O 8-WSON (6x5); Manufacturer: Macronix; Power/Voltage: 1.65V ~ 3.6V; Operation Temperature: -40...+85; Help URL: https://www.digikey.com/en/products/detail/macronix/MX25R6435FZNIL0/6558605?s=N4IgTCBcDaILIA0wFYBKA2ALAZmQMQC0A5ASQBkAGEAXQF8g; Type: FLASH - NOR; Value: *; Tolerance: *; Note: *; Case: 8-WSON (6x5); PartNumber: MX25R6435FZNIL0

## Sheet 09_Antenna.SchDoc
size 420 x 297 mm; Author: Shpakov Dmitry; Address1: Address1; Address2: Address2; Address3: Address3; Address4: Address4; DocumentNumber: АБВГ.123456.001 Э3; SheetNumber: 10; SheetTotal: 13; Scale: 1:1; DocumentType: Схема электрическая принципиальная; FirstReferrence: АБВГ.123456.001
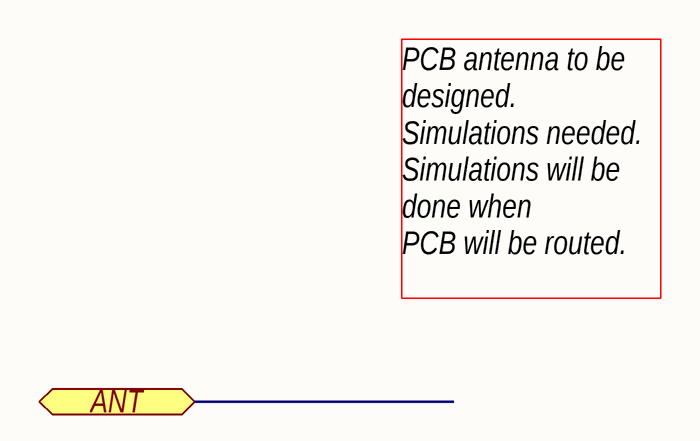
[diagram p9: 09_Antenna.SchDoc]

### Ports
ANT

### Notes on the sheet
- PCB antenna to be designed.
  Simulations needed.
  Simulations will be done when
  PCB will be routed.
- Author
- Manufacturer
- Date
- Page
- Total pages
- Size page
- A3
- Materials

## Sheet 10_Program_and_Debug_interface.SchDoc
size 420 x 297 mm; Author: Shpakov Dmitry; Address1: Address1; Address2: Address2; Address3: Address3; Address4: Address4; DocumentNumber: АБВГ.123456.001 Э3; SheetNumber: 11; SheetTotal: 13; Scale: 1:1; DocumentType: Схема электрическая принципиальная; FirstReferrence: АБВГ.123456.001
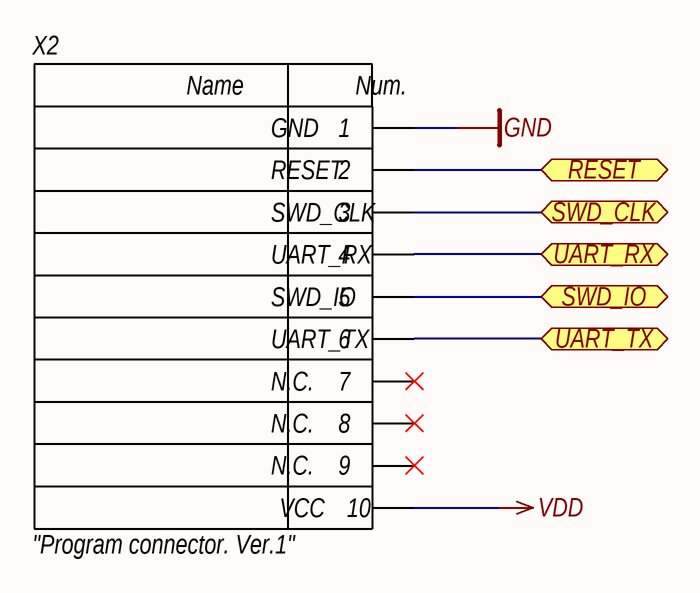
[diagram p10: 10_Program_and_Debug_interface.SchDoc]

### Parts
X2  "Program connector. Ver.1"  [10-pin 2.54mm TH]

### Ports
RESET, SWD_CLK, SWD_IO, UART_RX, UART_TX

### Nets
GND: X2.1(GND)
VDD: X2.10(VCC)
RESET: X2.2(RESET) ; port RESET
SWD_CLK: X2.3(SWD_CLK) ; port SWD_CLK
SWD_IO: X2.5(SWD_IO) ; port SWD_IO
UART_RX: X2.4(UART_RX) ; port UART_RX
UART_TX: X2.6(UART_TX) ; port UART_TX

Not connected (* = marked no-connect by the designer): X2 7(N.C.)* 8(N.C.)* 9(N.C.)*

### Notes on the sheet
- Author
- Manufacturer
- Date
- Page
- Total pages
- Size page
- A3
- Materials
- (in symbol 10-pin program connector. Ver.1) Name; Num.

### Library data of the parts
X2 = 10-pin program connector. Ver.1: 10-pin custom fixed layout program and debug connector.; Manufacturer: *; PartNumber: *; Help URL: *; Power/Voltage: *; Type: *; Value: *; Tolerance: *; Operation Temperature: *; Note: *; Case: *

## Sheet 11_Photovoltaic_input.SchDoc
size 420 x 297 mm; Author: Shpakov Dmitry; Address1: Address1; Address2: Address2; Address3: Address3; Address4: Address4; DocumentNumber: АБВГ.123456.001 Э3; SheetNumber: 12; SheetTotal: 13; Scale: 1:1; DocumentType: Схема электрическая принципиальная; FirstReferrence: АБВГ.123456.001
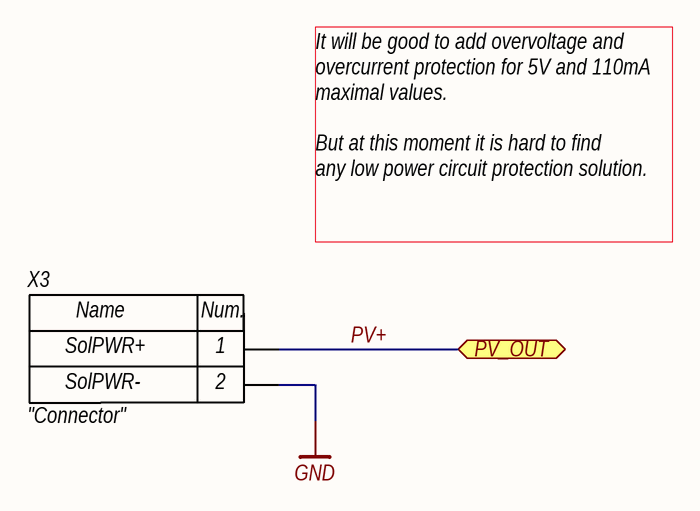
[diagram p11: 11_Photovoltaic_input.SchDoc]

### Parts
X3  "Connector"  [2-pin PCB power]

### Ports
PV_OUT

### Nets
GND: X3.2
PV+: X3.1 ; port PV_OUT

### Notes on the sheet
- It will be good to add overvoltage and
  overcurrent protection for 5V and 110mA
  maximal values.
  But at this moment it is hard to find
  any low power circuit protection solution.
- SolPWR+
- SolPWR-
- Author
- Manufacturer
- Date
- Page
- Total pages
- Size page
- A3
- Materials
- (in symbol 2-pin Power ConnectorSolderPCB) Name; Num.

### Library data of the parts
X3 = 2-pin Power ConnectorSolderPCB: Power connector. Solder on PCB.; Manufacturer: *; PartNumber: *; Help URL: *; Power/Voltage: *; Type: *; Value: *; Tolerance: *; Operation Temperature: *; Note: *; Case: *

## Sheet 12_Energy_storage.SchDoc
size 420 x 297 mm; Author: Shpakov Dmitry; Address1: Address1; Address2: Address2; Address3: Address3; Address4: Address4; DocumentNumber: АБВГ.123456.001 Э3; SheetNumber: 13; SheetTotal: 13; Scale: 1:1; DocumentType: Схема электрическая принципиальная; FirstReferrence: АБВГ.123456.001
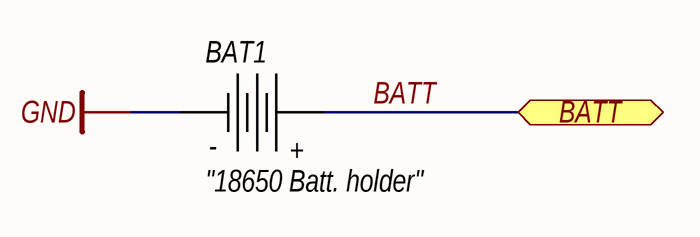
[diagram p12: 12_Energy_storage.SchDoc]

### Parts
BAT1  "18650 Batt. holder"  [18650_smd_keystone_1042]

### Ports
BATT

### Nets
GND: BAT1.1
BATT: BAT1.2 ; port BATT

### Notes on the sheet
- Author
- Manufacturer
- Date
- Page
- Total pages
- Size page
- A3
- Materials
- (in symbol SMD_battery_holder_18650) -; +

### Library data of the parts
BAT1 = SMD_battery_holder_18650: Battery holder 18650 SMD.; Manufacturer: Keystone Electronics; PartNumber: 1042; Operation Temperature: -50...+145; Help URL: https://www.digikey.com/en/products/detail/keystone-electronics/1042/2745668; Power/Voltage: *; Type: battery holder; Value: *; Tolerance: *; Note: *; Case: 18650

## Nets that join several sheets
GND: 01_MPPT_controller (12 pins), 02_nRF52840_power_clock (19 pins), 03_nRF52840_RF (C20.1 C21.1 D2.F23), 04_nRF52840_NFC_USB (D2.AD2), 06_nRF52840_Analog (R9.1 R10.1), 08_QSPI_64Mbit_Flash_Memory (5 pins), 10_Program_and_Debug_interface (X2.1), 11_Photovoltaic_input (X3.2), 12_Energy_storage (BAT1.1)
VDD: 01_MPPT_controller (C1.2 D1.14 R1.1), 02_nRF52840_power_clock (11 pins), 08_QSPI_64Mbit_Flash_Memory (C24.2 C25.1 C26.2 D3.8), 10_Program_and_Debug_interface (X2.10)
BATT: 01_MPPT_controller (D1.16), 06_nRF52840_Analog (R8.2), 12_Energy_storage (BAT1.2)
PV+: 01_MPPT_controller (D1.25 D1.26), 06_nRF52840_Analog (R7.2), 11_Photovoltaic_input (X3.1)
QSPI_CS#: 07_nRF52840_Digital (D2.AD12), 08_QSPI_64Mbit_Flash_Memory (D3.1)
QSPI_SCLK: 07_nRF52840_Digital (D2.AC15), 08_QSPI_64Mbit_Flash_Memory (D3.6)
QSPI_SIO0: 07_nRF52840_Digital (D2.AD16), 08_QSPI_64Mbit_Flash_Memory (D3.5)
QSPI_SIO1: 07_nRF52840_Digital (D2.AC17), 08_QSPI_64Mbit_Flash_Memory (D3.2)
QSPI_SIO2: 07_nRF52840_Digital (D2.AD18), 08_QSPI_64Mbit_Flash_Memory (D3.3)
QSPI_SIO3: 07_nRF52840_Digital (D2.AC19), 08_QSPI_64Mbit_Flash_Memory (D3.7)
RESET: 02_nRF52840_power_clock (D2.AC13), 10_Program_and_Debug_interface (X2.2)
STATUS1: 01_MPPT_controller (R1.2 VT1.3), 07_nRF52840_Digital (D2.V23)
SWD_CLK: 05_nRF52840_Debug_and_Trace (D2.AA24), 10_Program_and_Debug_interface (X2.3)
SWD_IO: 05_nRF52840_Debug_and_Trace (D2.AC24), 10_Program_and_Debug_interface (X2.5)
UART_RX: 07_nRF52840_Digital (D2.Y23), 10_Program_and_Debug_interface (X2.4)
UART_TX: 07_nRF52840_Digital (D2.W24), 10_Program_and_Debug_interface (X2.6)